# Altium schematic sheet 15_ETHERNET_CONN.SchDoc
size 297 x 209 mm
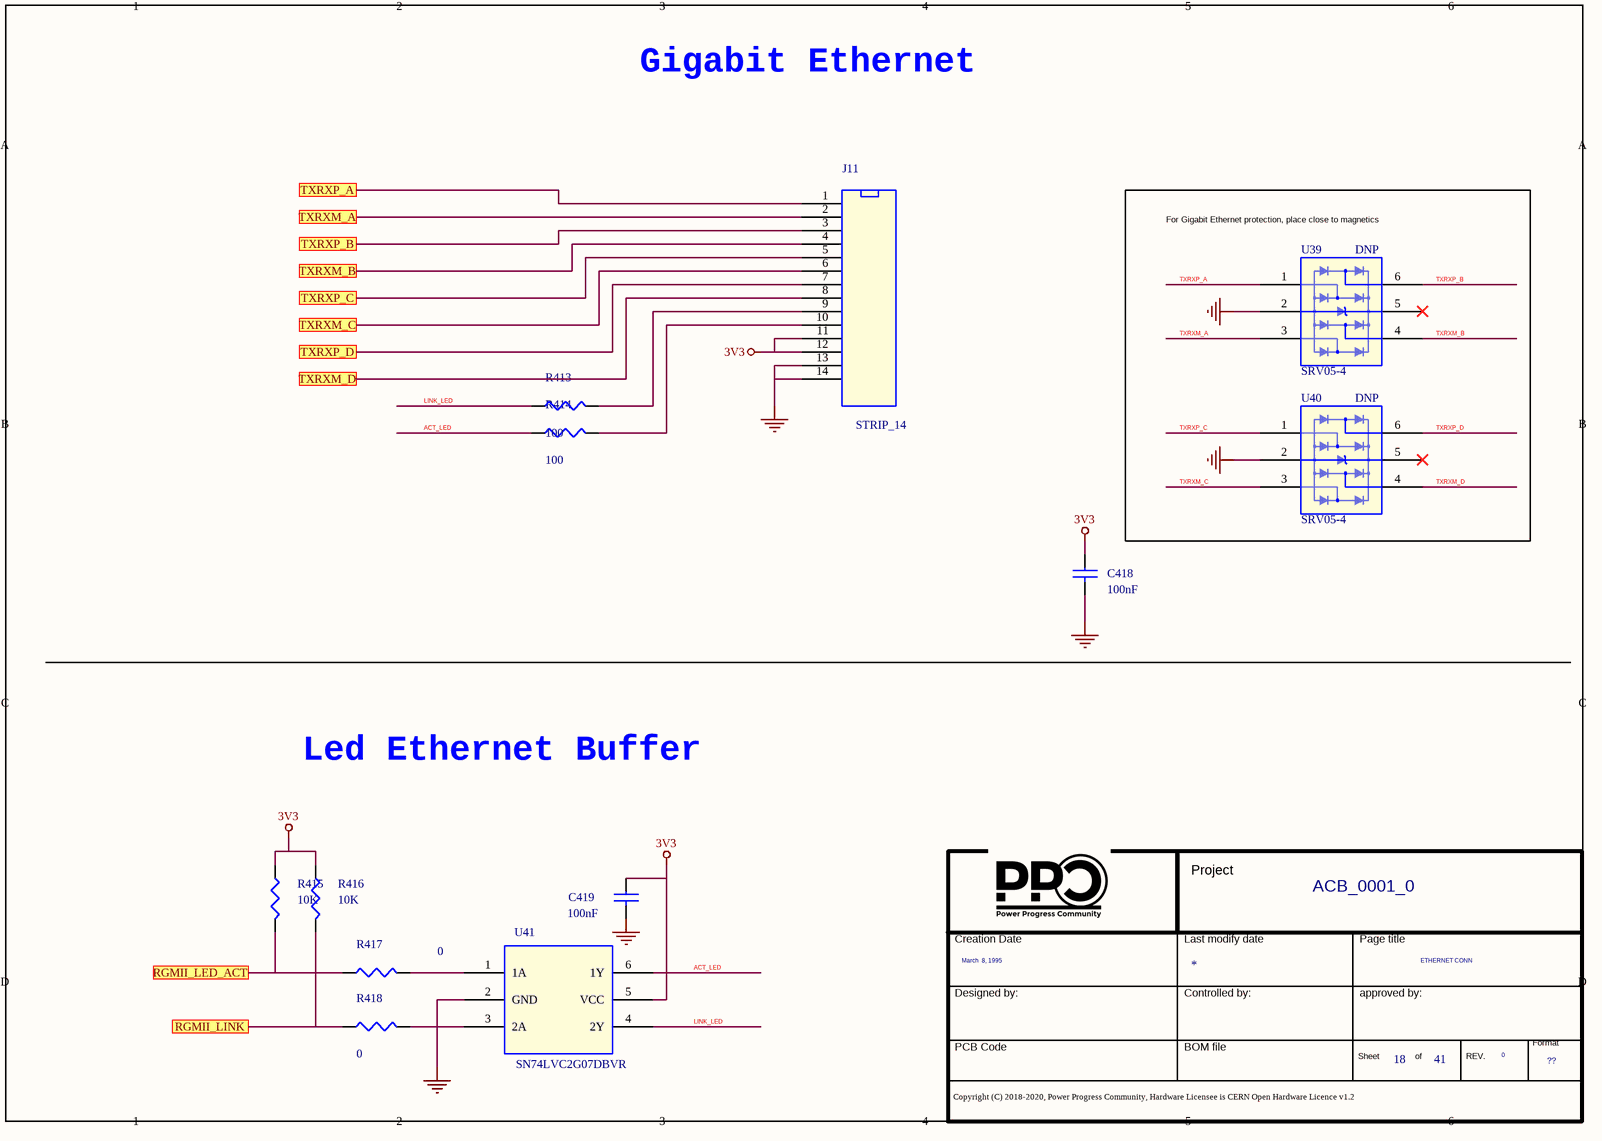
[diagram p0: 15_ETHERNET_CONN.SchDoc]

## Parts
*  Page Count: 41  Page Create Date: March  8, 1995  Page Number: 18  Page Size: ??  Page Title: ETHERNET CONN  RevCode: 0  Title: ACB_0001_0  (hidden comment: Title_block_PPC)  (graphical)
C418  100nF  [SMD_0402]
C419  100nF  [SMD_0402]
J11  STRIP_14  [SMD_2X50_P=0.635mm]
R413  100  [SMD_0402]
R414  100  [SMD_0402]
R415  10K  [SMD_0402]
R416  10K  [SMD_0402]
R417  0  [SMD_0402]
R418  0  [SMD_0402]
U39  SRV05-4  BOM_IGNORE: DNP  [SOT23_6]
U40  SRV05-4  BOM_IGNORE: DNP  [SOT23_6]
U41  SN74LVC2G07DBVR  [ 	SOT-26]

## Blocks framed on the sheet
For Gigabit Ethernet protection, place close to magnetics: U39 U40

## Ports
RGMII_LED_ACT, RGMII_LINK, TXRXM_A, TXRXM_B, TXRXM_C, TXRXM_D, TXRXP_A, TXRXP_B, TXRXP_C, TXRXP_D

## Nets
3V3: C418.1 C419.1 J11.11 J11.12 R415.1 R416.1 U41.5(VCC)
GND: C418.2 C419.2 J11.13 J11.14 U39.2 U40.2 U41.2(GND)
ACT_LED: R414.1 U41.6(1Y)
LINK_LED: R413.1 U41.4(2Y)
RGMII_LED_ACT: R415.2 R417.2 ; port RGMII_LED_ACT
RGMII_LINK: R416.2 R418.2 ; port RGMII_LINK
TXRXM_A: J11.2 ; port TXRXM_A
TXRXM_A: U39.3  [a separate net that carries the same name]
TXRXM_B: J11.4 ; port TXRXM_B
TXRXM_B: U39.4  [a separate net that carries the same name]
TXRXM_C: J11.6 ; port TXRXM_C
TXRXM_C: U40.3  [a separate net that carries the same name]
TXRXM_D: J11.8 ; port TXRXM_D
TXRXM_D: U40.4  [a separate net that carries the same name]
TXRXP_A: J11.1 ; port TXRXP_A
TXRXP_A: U39.1  [a separate net that carries the same name]
TXRXP_B: J11.3 ; port TXRXP_B
TXRXP_B: U39.6  [a separate net that carries the same name]
TXRXP_C: J11.5 ; port TXRXP_C
TXRXP_C: U40.1  [a separate net that carries the same name]
TXRXP_D: J11.7 ; port TXRXP_D
TXRXP_D: U40.6  [a separate net that carries the same name]
NetJ11_9: J11.9 R413.2
NetJ11_10: J11.10 R414.2
NetR417_1: R417.1 U41.1(1A)
NetR418_1: R418.1 U41.3(2A)

Not connected (* = marked no-connect by the designer): U39 5*; U40 5*

## Notes on the sheet
- Gigabit Ethernet
- Led Ethernet Buffer
- (in symbol Title_block_PPC) Project; Creation Date; Last modify date; Page title; Designed by:; Controlled by:; approved by:; Format; PCB Code; BOM file; Sheet; of; REV.; Copyright (C) 2018-2020, Power Progress Community, Hardware Licensee is CERN Open Hardware Licence v1.2

## Library data of the parts
* = Title_block_PPC: Schematic Page Count: 45; Schematic Page Number: 20; Page Modify Date: *
C418 = CAP NP_Dup9: COND.CER. 100NF 50V 0402 X7R SMD; LNK_PART: C0402X55; Manufacturer Part Number 1: CGA2B3X7R1H104M050BD; Manufacturer 1: TDK; Part Number: PASSIVE_24; ID: C1410; TECNO77: C0402; RSM: RC0402; PCB Footprint: SMD_0402; Distributor 1: MURATA ELETTRONICA SPA; Part Type: Capacitors\Ceramic\SMD\0402
C419 = CAP NP_Dup9: COND.CER. 100NF 50V 0402 X7R SMD; Part Number: PASSIVE_24; Manufacturer 1: TDK; Manufacturer Part Number 1: CGA2B3X7R1H104M050BD; LNK_PART: C0402X55; TECNO77: C0402; ID: C1411; RSM: RC0402; PCB Footprint: SMD_0402; Part Type: Capacitors\Ceramic\SMD\0402; Distributor 1: MURATA ELETTRONICA SPA
J11 = HEADER_14X1: STRIP MASCH 1X14P p=2.54mm PTH; PART NUMBER: CONNECTORS_497; Manufacturer 1: MOLEX; Manufacturer Part Number 1: 0022284143; RSM: PIN-100MLS-14; PCB Footprint: PTH; Part Type: Strip\Terminal; Distributor 1: DIGIKEY(WM50016-14-ND)
R413 R414 = R_Dup5: RESIS.CHIP 100R 5% 0402 SMD; Part Number: PASSIVE_812; Manufacturer 1: ROYAL OHM; RSM: RC0402; Part Type: Resistors\Fixed\SMD\0402\5%; PCB Footprint: SMD_0402; Manufacturer Part Number 1: RESIS.CHIP 100R 5% 0402 SMD
R415 R416 = R_Dup5: RESIS.CHIP 10K 1% 0402 SMD; Part Number: PASSIVE_584; Manufacturer 1: ROYAL OHM; RSM: RC0402; Part Type: Resistors\Fixed\SMD\0402\1%; PCB Footprint: SMD_0402; Manufacturer Part Number 1: RESIS.CHIP 10K 1% 0402 SMD
R417 = R_Dup8: RESIS.CHIP 0R 5% 0402 SMD; LNK_PART: R0402X55; Part Number: PASSIVE_805; Manufacturer 1: ROYAL OHM; ID: R2155; TECNO77: R0402; RSM: RC0402; PCB Footprint: SMD_0402; Part Type: Resistors\Fixed\SMD\0402\5%; Manufacturer Part Number 1: RESIS.CHIP 0R 5% 0402 SMD; Distributor 1: CAMEL ELETTRONICA SRL  #
R418 = R_Dup8: RESIS.CHIP 0R 5% 0402 SMD; LNK_PART: R0402X55; Part Number: PASSIVE_805; Manufacturer 1: ROYAL OHM; ID: R2156; TECNO77: R0402; RSM: RC0402; PCB Footprint: SMD_0402; Part Type: Resistors\Fixed\SMD\0402\5%; Manufacturer Part Number 1: RESIS.CHIP 0R 5% 0402 SMD; Distributor 1: CAMEL ELETTRONICA SRL  #
U39 U40 = SRV05-4_Dup1: TVS Diode Array5VWM 17.5VC USB; Manufacturer Part Number 1: SRV05-4.TCT; Manufacturer 1: Semtec; Part Number: DISCRETE_246; PCB Footprint: SOT23-6; Vendor: Semtech; RSM: SOT-23-6; Distributor 1: DIGIKEY (SRV05-4CT-ND); Part Type: Protections; MPN: SRV05-4.TCT; TYPE: IC
U41 = SN74LVC2G07DBVR: Buffer e line driver Dual w/ Open-Drain; Part Number: LOGIC_135; Manufacturer 1: TEXAS; PCB Footprint: SOT-26; TECNO77: SOT23-6; ID: U133; RSM: SOT-23-6; Part Type: LVC\DOUBLE GATE; Manufacturer Part Number 1: SN74LVC2G07DBVR; Distributor 1: MOUSER(595-SN74LVC2G07DBVR); LNK_PART: SN74LVC2G07DBVR